# EAGLE schematic 14A-010 (EAGLE 9.6.2)
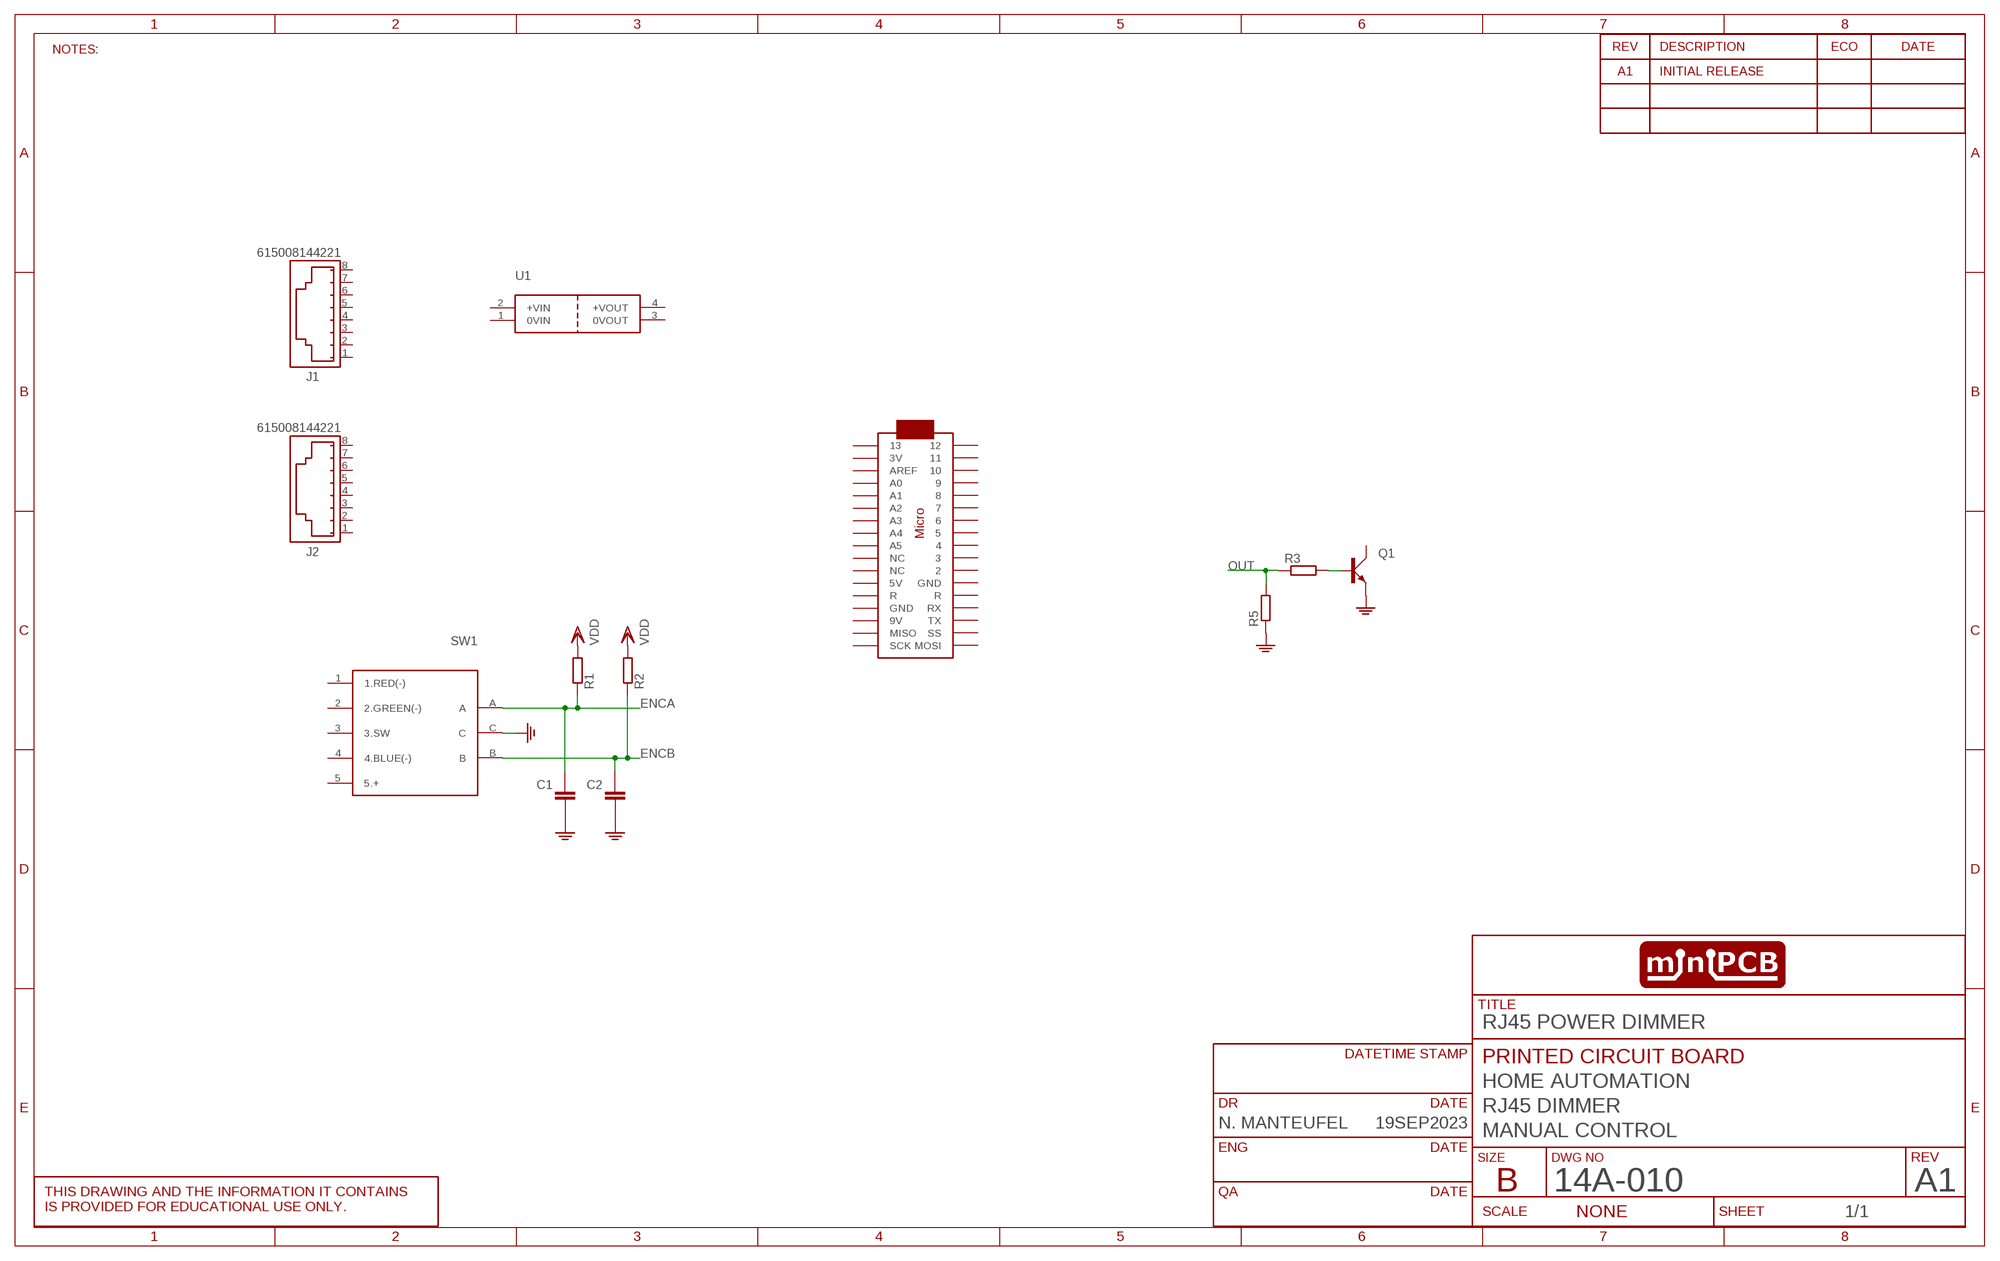
[diagram p0: schematic, sheet 1]
SHEET1 (SCHEMATIC): CIRCUIT_CATEGORY: HOME AUTOMATION; CIRCUIT_NAME: RJ45 DIMMER; CIRCUIT_VARIANT: MANUAL CONTROL; DR: N. MANTEUFEL; DR_DATE: 19SEP2023; PCB_PCBA: PRINTED CIRCUIT BOARD; REVA: A1; REVISION: A1; TITLE: RJ45 POWER DIMMER

## Parts
C1  CAPACITORSMD  [C0805]
C2  CAPACITORSMD  [C0805]
J1  615008144221  [615008144221]
J2  615008144221  [615008144221]
Q1  BJT_NPNBCE  [SOT223]
R1  RESISTORSMD  [R0805]
R2  RESISTORSMD  [R0805]
R3  RESISTORSMD  [R0805]
R5  RESISTORSMD  [R0805]
SW1  SWITCH-ROTARY_ENCODER+SW+3LEDSPEL12T  [SWITCH-ROTARY_ENCODER-12MM]
U1  DCDC_ISOLATORRFM-XXXXS  [RFM-XXXXS]
U$2  ARDUINOMICRO  [ARDUINOMICRO]

## Nets
ENCA: C1.1ASD(+) R1.1 SW1.A
ENCB: C2.1ASD(+) R2.1 SW1.B
GND: C1.2ASDF(-) C2.2ASDF(-) Q1.3(E) R5.1 SW1.C
N$1: Q1.1(B) R3.2
OUT: R3.1 R5.2
VDD: R1.2 R2.2
Unconnected: J1.1 J1.2 J1.3 J1.4 J1.5 J1.6 J1.7 J1.8 J2.1 J2.2 J2.3 J2.4 J2.5 J2.6 J2.7 J2.8 Q1.2(C) Q1.4.TAB(C) SW1.1(1.RED(-)) SW1.2(2.GREEN(-)) SW1.3(3.SW) SW1.4(4.BLUE(-)) SW1.5(5.+) U1.1(0VIN) U1.2(+VIN) U1.3(0VOUT) U1.4(+VOUT) U$2.P$1 U$2.P$2 U$2.P$3 U$2.P$4 U$2.P$5 U$2.P$6 U$2.P$7 U$2.P$8 U$2.P$9 U$2.P$10 U$2.P$11 U$2.P$12(GND) U$2.P$13(R) U$2.P$14(RX) U$2.P$15(TX) U$2.P$16(SS) U$2.P$17(MOSI) U$2.P$18(SCK) U$2.P$19(MISO) U$2.P$20(9V) U$2.P$21(GND) U$2.P$22(R) U$2.P$23(5V) U$2.P$24(NC) U$2.P$25(NC) U$2.P$26(A5) U$2.P$27(A4) U$2.P$28(A3) U$2.P$29(A2) U$2.P$30(A1) U$2.P$31(A0) U$2.P$32(AREF) U$2.P$33(3V) U$2.P$34

## Notes on the sheet
- NOTES:

## Library data of the parts
C1 C2 = minipcb:CAPACITOR
J1 J2 = SIG_CONNECTORS:615008144221: WR-MJ Modular Jack Vertical Plastic 8P8C w. Ears Kind Properties Quality Class:500 Mating cycles General Information Operating Temperature:-40 up to +85 °C Compliance:RoHS Electrical Properties IR 1:1.5 A Working Voltage:120V (AC) Withstanding Voltage:1000V (AC) Contact Resistance:20mΩ RISO:500 MΩ Material Properties Insulator MateriaL:PBT Insulator Flammability Rating:UL94 V-0 Color:Black Contact Material Copper Alloy Contact Plating: Gold Contact Type:Stamped Packaging Properties Packaging:Tray <https://www.we-online.com/catalog/media/o33134v209%20Family_WR-MJ_615008144221.jpg> Details see: https://www.we-online.com/catalog/en/MJ_VERTICAL_PLASTIC_8P8C_W_EARS/ Updated by Ella Wu 2020-06-30 2020(C) Würth Elektronik; DATASHEET-URL: https://www.we-online.com/redexpert/spec/615008144221?ae; MFG1: WURTH ELEKTRONIK; MFG1_PN: 61500814221; MOUNT: THT; PART-NUMBER: 615008144221; TYPE: Vertical; XPXC: 8P8C
Q1 = minipcb:BJT_NPN: TRANSISTOR
R1-R3 R5 = minipcb:RESISTOR
SW1 = minipcb:SWITCH-ROTARY_ENCODER+SW+3LEDS: PEL12T - 12 mm Encoder with Switch and Illuminated Shaft PEL12T-4xxxF-S1024
U1 = SIG_ICS:DCDC_ISOLATOR
U$2 = SIG_ICS:ARDUINOMICRO